# Altium schematic sheet FPGA_Socket.SchDoc: FPGA_Socket
size OrCAD A; Engineer: Benjamin Beaudoin; Revision: vX.X
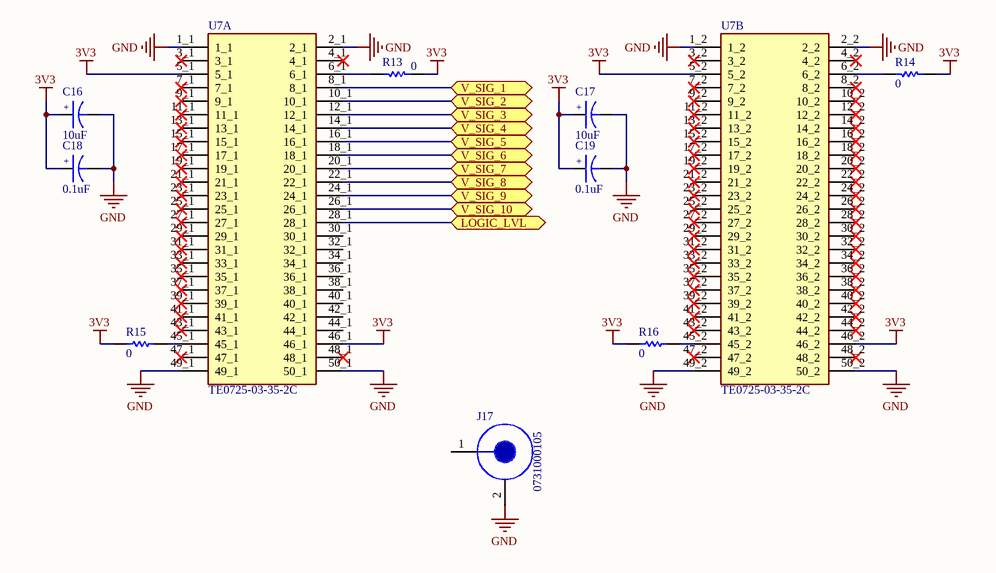
[diagram p0: FPGA_Socket.SchDoc]

## Parts
C16  10uF  [0603C]
C17  10uF  [0603C]
C18  0.1uF  [0603C]
C19  0.1uF  [0603C]
J17  0731000105  [0731000105]
R13  0  [0603C]
R14  0  [0603C]
R15  0  [0603C]
R16  0  [0603C]
U7  TE0725-03-35-2C  [MODULE_TE0725-03-35-2C]  (parts A,B of 2)

## Ports
LOGIC_LVL, V_SIG_1, V_SIG_2, V_SIG_3, V_SIG_4, V_SIG_5, V_SIG_6, V_SIG_7, V_SIG_8, V_SIG_9, V_SIG_10

## Nets
3V3: C16.1 C17.1 C18.1 C19.1 R13.1 R14.1 R15.1 R16.1 U7.5_1 U7.5_2 U7.46_1 U7.46_2
GND: C16.2 C17.2 C18.2 C19.2 J17.2 U7.1_1 U7.1_2 U7.2_1 U7.2_2 U7.49_1 U7.49_2 U7.50_1 U7.50_2
LOGIC_LVL: U7.28_1 ; port LOGIC_LVL
V_SIG_1: U7.8_1 ; port V_SIG_1
V_SIG_2: U7.10_1 ; port V_SIG_2
V_SIG_3: U7.12_1 ; port V_SIG_3
V_SIG_4: U7.14_1 ; port V_SIG_4
V_SIG_5: U7.16_1 ; port V_SIG_5
V_SIG_6: U7.18_1 ; port V_SIG_6
V_SIG_7: U7.20_1 ; port V_SIG_7
V_SIG_8: U7.22_1 ; port V_SIG_8
V_SIG_9: U7.24_1 ; port V_SIG_9
V_SIG_10: U7.26_1 ; port V_SIG_10
NetR13_2: R13.2 U7.6_1
NetR14_2: R14.2 U7.6_2
NetR15_2: R15.2 U7.45_1
NetR16_2: R16.2 U7.45_2

Not connected (* = marked no-connect by the designer): J17 1; U7 3_1* 3_2* 4_1* 4_2* 7_1* 7_2* 8_2* 9_1* 9_2* 10_2* 11_1* 11_2* 12_2* 13_1* 13_2* 14_2* 15_1* 15_2* 16_2* 17_1* 17_2* 18_2* 19_1* 19_2* 20_2* 21_1* 21_2* 22_2* 23_1* 23_2* 24_2* 25_1* 25_2* 26_2* 27_1* 27_2* 28_2* 29_1* 29_2* 30_1 30_2* 31_1* 31_2* 32_1 32_2* 33_1* 33_2* 34_1 34_2* 35_1* 35_2* 36_1 36_2* 37_1* 37_2* 38_1 38_2* 39_1* 39_2* 40_1 40_2* 41_1* 41_2* 42_1 42_2* 43_1* 43_2* 44_1 44_2* 47_1* 47_2* 48_1* 48_2*

## Notes on the sheet
- (in symbol CPoly) +

## Library data of the parts
C16-C19 = CPoly: Cap Poly; Power_WV_SRF: 35V; MFG: *; MFGPN: *; Tolerance: *; Temp Coef: *; Distributor Reg Num: *; Distributor: *; CMPN: *
  C16 C17: Value: 10uF
  C18 C19: Value: 0.1uF
J17 = 0731000105: BNC Connector Jack, Female Socket 50Ohm Through Hole, Right Angle Solder
R13-R16 = R: Resistor; Tolerance: 5%; Value: 0; Power_WV_SRF: *; MFG: *; MFGPN: *; Distributor: *; CMPN: *
U7 = TE0725-03-35-2C: TE0725 Embedded Module Artix-7 A35T 100MHz 32MB; MF: Trenz Electronic GmbH; Package: Trenz Electronic GmbH; Value: *; Availability: Unavailable; SnapEDA_Link: https://www.snapeda.com/parts/TE0725-03-35-2C/Trenz%20Electronic%20GmbH/view-part/4794770/?ref=snap; MP: TE0725-03-35-2C; Price: None